# EAGLE design robot_main_board (EAGLE 9.0.0)
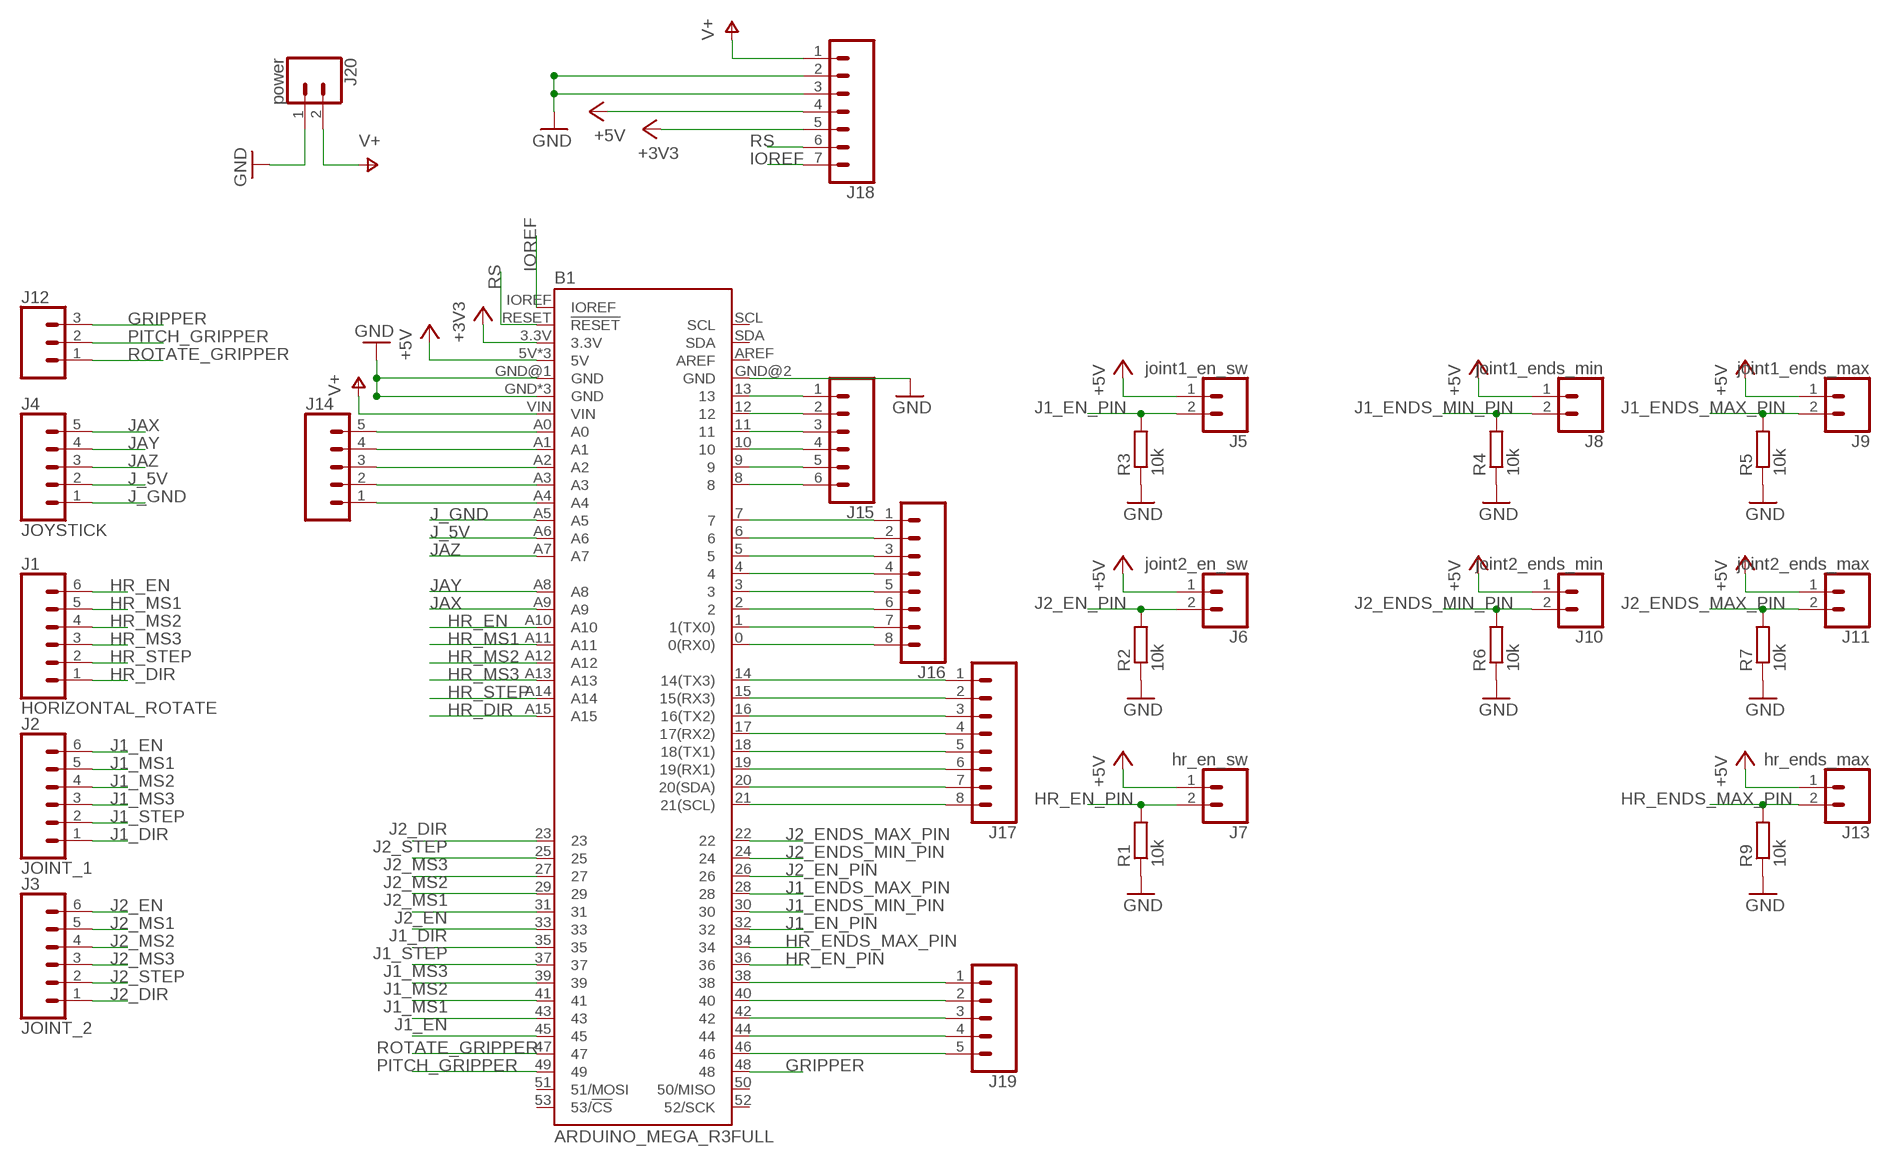
[diagram p0: schematic, sheet 1]

## Parts
B1  ARDUINO_MEGA_R3FULL  [ARDUINO_MEGA_NO_SILK]
J1  HORIZONTAL_ROTATE  CONN_06POLAR  [MOLEX-1X6]
J2  JOINT_1  CONN_06POLAR  [MOLEX-1X6]
J3  JOINT_2  CONN_06POLAR  [MOLEX-1X6]
J4  JOYSTICK  CONN_05  [1X05]
J5  joint1_en_sw  CONN_02POLAR  [MOLEX-1X2]
J6  joint2_en_sw  CONN_02POLAR  [MOLEX-1X2]
J7  hr_en_sw  CONN_02POLAR  [MOLEX-1X2]
J8  joint1_ends_min  CONN_02POLAR  [MOLEX-1X2]
J9  joint1_ends_max  CONN_02POLAR  [MOLEX-1X2]
J10  joint2_ends_min  CONN_02POLAR  [MOLEX-1X2]
J11  joint2_ends_max  CONN_02POLAR  [MOLEX-1X2]
J12  CONN_03POLAR  [MOLEX-1X3]
J13  hr_ends_max  CONN_02POLAR  [MOLEX-1X2]
J14  CONN_05  [1X05]
J15  CONN_06SILK_FEMALE_PTH  [1X06]
J16  CONN_08"  [1X08]
J17  CONN_08"  [1X08]
J18  CONN_07  [1X07]
J19  CONN_05  [1X05]
J20  power  CONN_02POLAR  [MOLEX-1X2]
R1  10k  R-EU_0204/7  [0204/7]
R2  10k  R-EU_0204/7  [0204/7]
R3  10k  R-EU_0204/7  [0204/7]
R4  10k  R-EU_0204/7  [0204/7]
R5  10k  R-EU_0204/7  [0204/7]
R6  10k  R-EU_0204/7  [0204/7]
R7  10k  R-EU_0204/7  [0204/7]
R9  10k  R-EU_0204/7  [0204/7]

## Nets
+3V3: B1.3.3V J18.5
+5V: B1.5V B1.5V@1(5V) B1.5V@2(5V) J5.1 J6.1 J7.1 J8.1 J9.1 J10.1 J11.1 J13.1 J18.4
GND: B1.GND B1.GND@1(GND) B1.GND@2(GND) B1.GND@3(GND) B1.GND@4(GND) J18.2 J18.3 J20.1 R1.1 R2.1 R3.1 R4.1 R5.1 R6.1 R7.1 R9.1
GRIPPER: B1.48 J12.3
HR_DIR: B1.A15 J1.1
HR_EN: B1.A10 J1.6
HR_EN_PIN: B1.36 J7.2 R1.2
HR_ENDS_MAX_PIN: B1.34 J13.2 R9.2
HR_MS1: B1.A11 J1.5
HR_MS2: B1.A12 J1.4
HR_MS3: B1.A13 J1.3
HR_STEP: B1.A14 J1.2
IOREF: B1.IOREF J18.7
J1_DIR: B1.35 J2.1
J1_EN: B1.45 J2.6
J1_EN_PIN: B1.32 J5.2 R3.2
J1_ENDS_MAX_PIN: B1.28 J9.2 R5.2
J1_ENDS_MIN_PIN: B1.30 J8.2 R4.2
J1_MS1: B1.43 J2.5
J1_MS2: B1.41 J2.4
J1_MS3: B1.39 J2.3
J1_STEP: B1.37 J2.2
J2_DIR: B1.23 J3.1
J2_EN: B1.33 J3.6
J2_EN_PIN: B1.26 J6.2 R2.2
J2_ENDS_MAX_PIN: B1.22 J11.2 R7.2
J2_ENDS_MIN_PIN: B1.24 J10.2 R6.2
J2_MS1: B1.31 J3.5
J2_MS2: B1.29 J3.4
J2_MS3: B1.27 J3.3
J2_STEP: B1.25 J3.2
J_5V: B1.A6 J4.2
J_GND: B1.A5 J4.1
JAX: B1.A9 J4.5
JAY: B1.A8 J4.4
JAZ: B1.A7 J4.3
N$1: B1.A4 J14.1
N$2: B1.A3 J14.2
N$3: B1.A2 J14.3
N$4: B1.A1 J14.4
N$5: B1.A0 J14.5
N$6: B1.13 J15.1
N$7: B1.12 J15.2
N$8: B1.11 J15.3
N$9: B1.10 J15.4
N$10: B1.9 J15.5
N$11: B1.8 J15.6
N$12: B1.7 J16.1
N$13: B1.6 J16.2
N$14: B1.5 J16.3
N$15: B1.4 J16.4
N$16: B1.3 J16.5
N$17: B1.2 J16.6
N$18: B1.1(1(TX0)) J16.7
N$19: B1.0(0(RX0)) J16.8
N$20: B1.14(14(TX3)) J17.1
N$21: B1.15(15(RX3)) J17.2
N$22: B1.16(16(TX2)) J17.3
N$23: B1.17(17(RX2)) J17.4
N$24: B1.18(18(TX1)) J17.5
N$25: B1.19(19(RX1)) J17.6
N$26: B1.20(20(SDA)) J17.7
N$27: B1.21(21(SCL)) J17.8
N$28: B1.38 J19.1
N$29: B1.40 J19.2
N$30: B1.42 J19.3
N$31: B1.44 J19.4
N$32: B1.46 J19.5
PITCH_GRIPPER: B1.49 J12.2
ROTATE_GRIPPER: B1.47 J12.1
RS: B1.RESET(!RESET) J18.6
V+: B1.VIN J18.1 J20.2
Unconnected: B1.50(50/MISO) B1.51(51/MOSI) B1.52(52/SCK) B1.53(53/!CS) B1.AREF B1.SCL B1.SDA

## Library data of the parts
B1 = SparkFun-Boards:ARDUINO_MEGA_R3: Arduino Mega R3 ATmega2560 R3 compatible footprint. SparkFun Products: Arduino Mega 2560 R3 <https://www.sparkfun.com/products/11061>
J1-J3 = SparkFun-Connectors:CONN_06: Multi connection point. Often used as Generic Header-pin footprint for 0.1 inch spaced/style header connections On any of the 0.1 inch spaced packages, you can populate with these: Break Away Headers - Straight <https://www.sparkfun.com/products/116> (PRT-00116) Break Away Male Headers - Right Angle <https://www.sparkfun.com/products/553> (PRT-00553) Female Headers <https://www.sparkfun.com/products/115> (PRT-00115) Break Away Headers - Machine Pin <https://www.sparkfun.com/products/117> (PRT-00117) Break Away Female Headers - Swiss Machine Pin <https://www.sparkfun.com/products/743> (PRT-00743) Arduino Stackable Header - 6 Pin <https://www.sparkfun.com/products/9280> (PRT-09280) For SCREWTERMINALS and SPRING TERMINALS visit here: Screw Terimnals on SparkFun.com <https://www.sparkfun.com/search/results?term=Screw+Terminals> (5mm/3.5mm/2.54mm spacing) This device is also useful as a general connection point to wire up your design to another part of your project. Our various solder wires solder well into these plated through hole pads. Hook-Up Wire - Assortment (Stranded, 22 AWG) <https://www.sparkfun.com/products/11375> (PRT-11375) Hook-Up Wire - Assortment (Solid Core, 22 AWG) <https://www.sparkfun.com/products/11367> (PRT-11367) View the entire wire category on our website here <https://www.sparkfun.com/categories/141>
J4 J14 J19 = SparkFun-Connectors:CONN_05: Multi connection point. Often used as Generic Header-pin footprint for 0.1 inch spaced/style header connections On any of the 0.1 inch spaced packages, you can populate with these: Break Away Headers - Straight <https://www.sparkfun.com/products/116> (PRT-00116) Break Away Male Headers - Right Angle <https://www.sparkfun.com/products/553> (PRT-00553) Female Headers <https://www.sparkfun.com/products/115> (PRT-00115) Break Away Headers - Machine Pin <https://www.sparkfun.com/products/117> (PRT-00117) Break Away Female Headers - Swiss Machine Pin <https://www.sparkfun.com/products/743> (PRT-00743) For SCREWTERMINALS and SPRING TERMINALS visit here: Screw Terimnals on SparkFun.com <https://www.sparkfun.com/search/results?term=Screw+Terminals> (5mm/3.5mm/2.54mm spacing) This device is also useful as a general connection point to wire up your design to another part of your project. Our various solder wires solder well into these plated through hole pads. Hook-Up Wire - Assortment (Stranded, 22 AWG) <https://www.sparkfun.com/products/11375> (PRT-11375) Hook-Up Wire - Assortment (Solid Core, 22 AWG) <https://www.sparkfun.com/products/11367> (PRT-11367) View the entire wire category on our website here <https://www.sparkfun.com/categories/141> Special notes: Molex polarized connector foot print use with SKU : PRT-08231 with associated crimp pins and housings. 1MM SMD Version SKU: PRT-10208
J5-J11 J13 J20 = SparkFun-Connectors:CONN_02: Multi connection point. Often used as Generic Header-pin footprint for 0.1 inch spaced/style header connections On any of the 0.1 inch spaced packages, you can populate with these: Break Away Headers - Straight <https://www.sparkfun.com/products/116> (PRT-00116) Break Away Male Headers - Right Angle <https://www.sparkfun.com/products/553> (PRT-00553) Female Headers <https://www.sparkfun.com/products/115> (PRT-00115) Break Away Headers - Machine Pin <https://www.sparkfun.com/products/117> (PRT-00117) Break Away Female Headers - Swiss Machine Pin <https://www.sparkfun.com/products/743> (PRT-00743) For SCREWTERMINALS and SPRING TERMINALS visit here: Screw Terimnals on SparkFun.com <https://www.sparkfun.com/search/results?term=Screw+Terminals> (5mm/3.5mm/2.54mm spacing) This device is also useful as a general connection point to wire up your design to another part of your project. Our various solder wires solder well into these plated through hole pads. Hook-Up Wire - Assortment (Stranded, 22 AWG) <https://www.sparkfun.com/products/11375> (PRT-11375) Hook-Up Wire - Assortment (Solid Core, 22 AWG) <https://www.sparkfun.com/products/11367> (PRT-11367) View the entire wire category on our website here <https://www.sparkfun.com/categories/141> Special notes: Molex polarized connector foot print use with: PRT-08233 with associated crimp pins and housings. 2.54_SCREWTERM for use with PRT-10571. 3.5mm Screw Terminal footprints for PRT-08084 5mm Screw Terminal footprints for use with PRT-08432; SF_ID: PRT-09918
J12 = SparkFun-Connectors:CONN_03: Multi connection point. Often used as Generic Header-pin footprint for 0.1 inch spaced/style header connections On any of the 0.1 inch spaced packages, you can populate with these: Break Away Headers - Straight <https://www.sparkfun.com/products/116> (PRT-00116) Break Away Male Headers - Right Angle <https://www.sparkfun.com/products/553> (PRT-00553) Female Headers <https://www.sparkfun.com/products/115> (PRT-00115) Break Away Headers - Machine Pin <https://www.sparkfun.com/products/117> (PRT-00117) Break Away Female Headers - Swiss Machine Pin <https://www.sparkfun.com/products/743> (PRT-00743) Stackable Header - 3 Pin (Female, 0.1") <https://www.sparkfun.com/products/13875> (PRT-13875) For SCREWTERMINALS and SPRING TERMINALS visit here: Screw Terimnals on SparkFun.com <https://www.sparkfun.com/search/results?term=Screw+Terminals> (5mm/3.5mm/2.54mm spacing) This device is also useful as a general connection point to wire up your design to another part of your project. Our various solder wires solder well into these plated through hole pads. Hook-Up Wire - Assortment (Stranded, 22 AWG) <https://www.sparkfun.com/products/11375> (PRT-11375) Hook-Up Wire - Assortment (Solid Core, 22 AWG) <https://www.sparkfun.com/products/11367> (PRT-11367) View the entire wire category on our website here <https://www.sparkfun.com/categories/141> Special notes: Molex polarized connector foot print use with SKU : PRT-08232 with associated crimp pins and housings.; PROD_ID: CONN-08625; SF_ID: PRT-08096
J15 = SparkFun-Connectors:CONN_06: Multi connection point. Often used as Generic Header-pin footprint for 0.1 inch spaced/style header connections On any of the 0.1 inch spaced packages, you can populate with these: Break Away Headers - Straight <https://www.sparkfun.com/products/116> (PRT-00116) Break Away Male Headers - Right Angle <https://www.sparkfun.com/products/553> (PRT-00553) Female Headers <https://www.sparkfun.com/products/115> (PRT-00115) Break Away Headers - Machine Pin <https://www.sparkfun.com/products/117> (PRT-00117) Break Away Female Headers - Swiss Machine Pin <https://www.sparkfun.com/products/743> (PRT-00743) Arduino Stackable Header - 6 Pin <https://www.sparkfun.com/products/9280> (PRT-09280) For SCREWTERMINALS and SPRING TERMINALS visit here: Screw Terimnals on SparkFun.com <https://www.sparkfun.com/search/results?term=Screw+Terminals> (5mm/3.5mm/2.54mm spacing) This device is also useful as a general connection point to wire up your design to another part of your project. Our various solder wires solder well into these plated through hole pads. Hook-Up Wire - Assortment (Stranded, 22 AWG) <https://www.sparkfun.com/products/11375> (PRT-11375) Hook-Up Wire - Assortment (Solid Core, 22 AWG) <https://www.sparkfun.com/products/11367> (PRT-11367) View the entire wire category on our website here <https://www.sparkfun.com/categories/141>; PROD_ID: CONN-08437
J16 J17 = SparkFun-Connectors:CONN_08: Multi connection point. Often used as Generic Header-pin footprint for 0.1 inch spaced/style header connections On any of the 0.1 inch spaced packages, you can populate with these: Break Away Headers - Straight <https://www.sparkfun.com/products/116> (PRT-00116) Break Away Male Headers - Right Angle <https://www.sparkfun.com/products/553> (PRT-00553) Female Headers <https://www.sparkfun.com/products/115> (PRT-00115) Break Away Headers - Machine Pin <https://www.sparkfun.com/products/117> (PRT-00117) Break Away Female Headers - Swiss Machine Pin <https://www.sparkfun.com/products/743> (PRT-00743) Arduino Stackable Header - 8 Pin <https://www.sparkfun.com/products/9279> (PRT-09279) For SCREWTERMINALS and SPRING TERMINALS visit here: Screw Terimnals on SparkFun.com <https://www.sparkfun.com/search/results?term=Screw+Terminals> (5mm/3.5mm/2.54mm spacing) This device is also useful as a general connection point to wire up your design to another part of your project. Our various solder wires solder well into these plated through hole pads. Hook-Up Wire - Assortment (Stranded, 22 AWG) <https://www.sparkfun.com/products/11375> (PRT-11375) Hook-Up Wire - Assortment (Solid Core, 22 AWG) <https://www.sparkfun.com/products/11367> (PRT-11367) View the entire wire category on our website here <https://www.sparkfun.com/categories/141> Special notes: Molex polarized connector foot print use with SKU : PRT-08231 with associated crimp pins and housings. 1MM SMD Version SKU: PRT-10208 NOTES ON THE VARIANTS LOCK and LOCK_LONGPADS... This footprint was designed to help hold the alignment of a through-hole component (i.e. 6-pin header) while soldering it into place. You may notice that each hole has been shifted either up or down by 0.005 of an inch from it's more standard position (which is a perfectly straight line). This slight alteration caused the pins (the squares in the middle) to touch the edges of the holes. Because they are alternating, it causes a "brace" to hold the component in place. 0.005 has proven to be the perfect amount of "off-center" position when using our standard breakaway headers. Although looks a little odd when you look at the bare footprint, once you have a header in there, the alteration is very hard to notice. Also,if you push a header all the way into place, it is covered up entirely on the bottom side.; PROD_ID: CONN-08438
J18 = SparkFun-Connectors:CONN_07: Multi connection point. Often used as Generic Header-pin footprint for 0.1 inch spaced/style header connections On any of the 0.1 inch spaced packages, you can populate with these: Break Away Headers - Straight <https://www.sparkfun.com/products/116> (PRT-00116) Break Away Male Headers - Right Angle <https://www.sparkfun.com/products/553> (PRT-00553) Female Headers <https://www.sparkfun.com/products/115> (PRT-00115) Break Away Headers - Machine Pin <https://www.sparkfun.com/products/117> (PRT-00117) Break Away Female Headers - Swiss Machine Pin <https://www.sparkfun.com/products/743> (PRT-00743) For SCREWTERMINALS and SPRING TERMINALS visit here: Screw Terimnals on SparkFun.com <https://www.sparkfun.com/search/results?term=Screw+Terminals> (5mm/3.5mm/2.54mm spacing) This device is also useful as a general connection point to wire up your design to another part of your project. Our various solder wires solder well into these plated through hole pads. Hook-Up Wire - Assortment (Stranded, 22 AWG) <https://www.sparkfun.com/products/11375> (PRT-11375) Hook-Up Wire - Assortment (Solid Core, 22 AWG) <https://www.sparkfun.com/products/11367> (PRT-11367) View the entire wire category on our website here <https://www.sparkfun.com/categories/141> Special notes: Molex polarized connector foot print use with SKU : PRT-08231 with associated crimp pins and housings. 1MM SMD Version SKU: PRT-10208 NOTES ON THE VARIANTS LOCK and LOCK_LONGPADS... This footprint was designed to help hold the alignment of a through-hole component (i.e. 6-pin header) while soldering it into place. You may notice that each hole has been shifted either up or down by 0.005 of an inch from it's more standard position (which is a perfectly straight line). This slight alteration caused the pins (the squares in the middle) to touch the edges of the holes. Because they are alternating, it causes a "brace" to hold the component in place. 0.005 has proven to be the perfect amount of "off-center" position when using our standard breakaway headers. Although looks a little odd when you look at the bare footprint, once you have a header in there, the alteration is very hard to notice. Also,if you push a header all the way into place, it is covered up entirely on the bottom side.
R1-R7 R9 = resistor:R-EU_: RESISTOR, European symbol

## Board
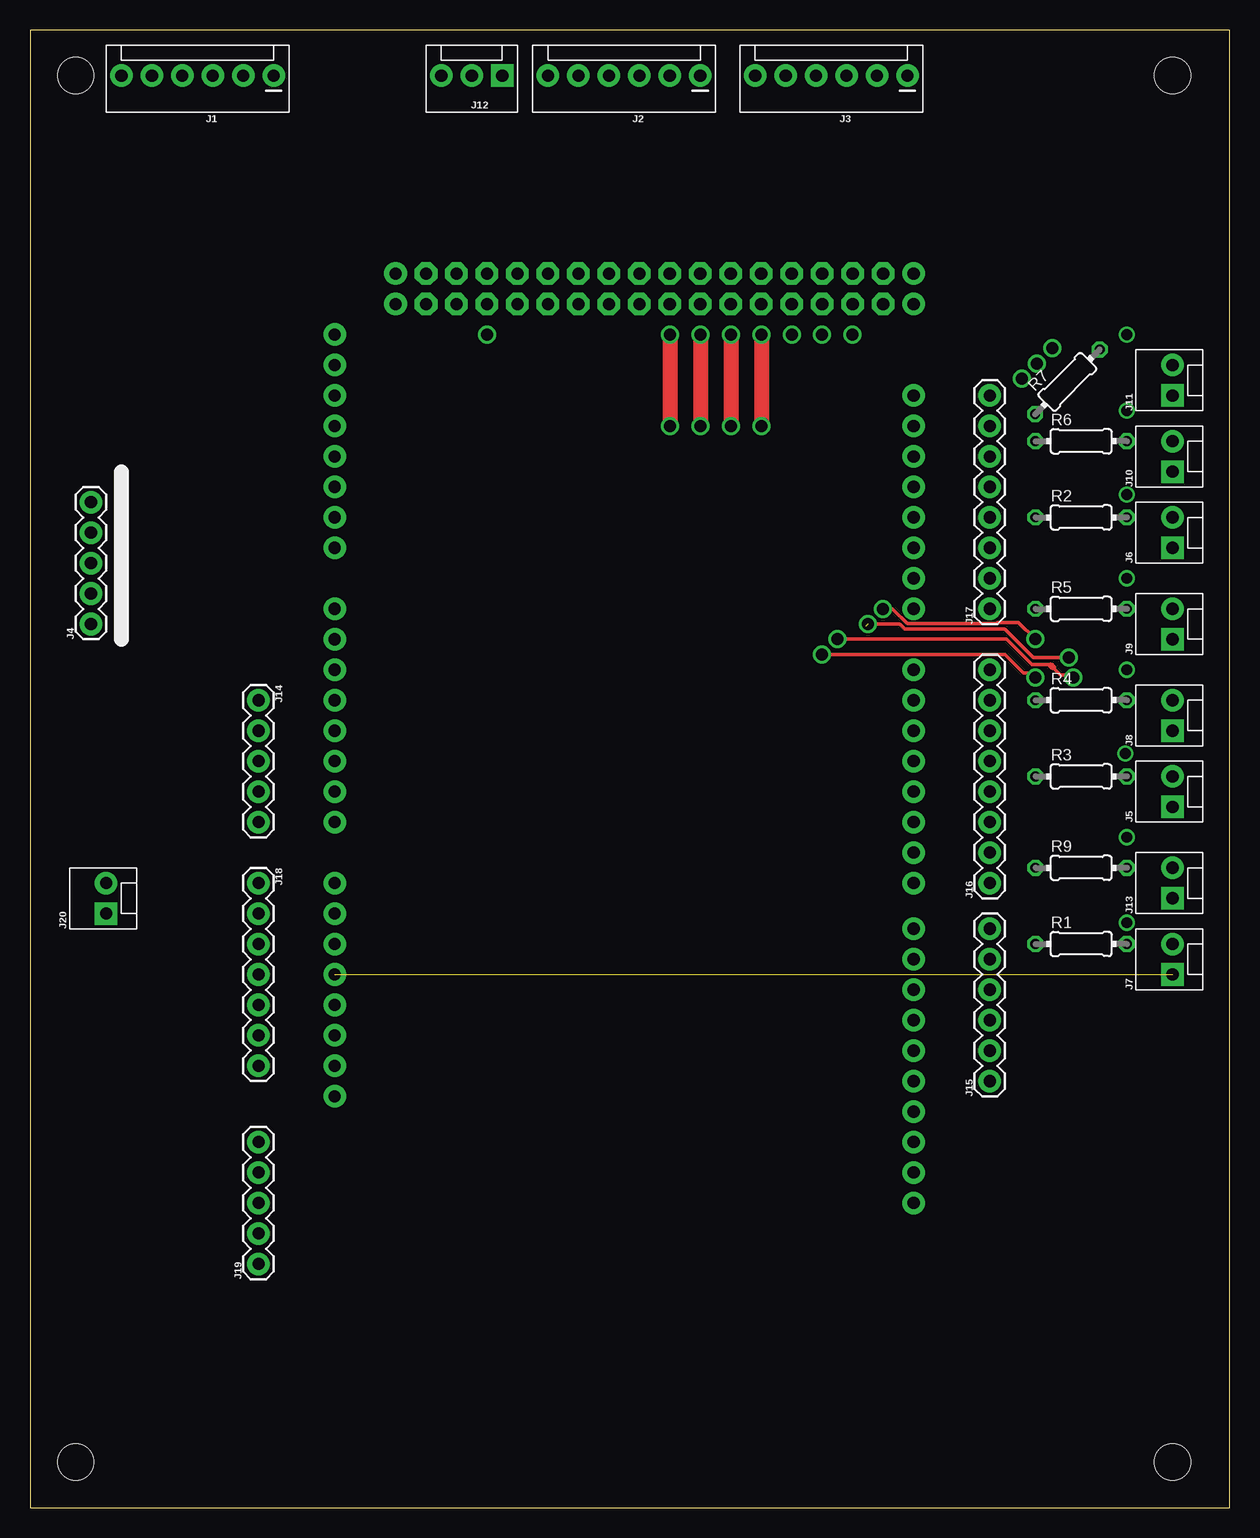
[diagram p1: board, top side]
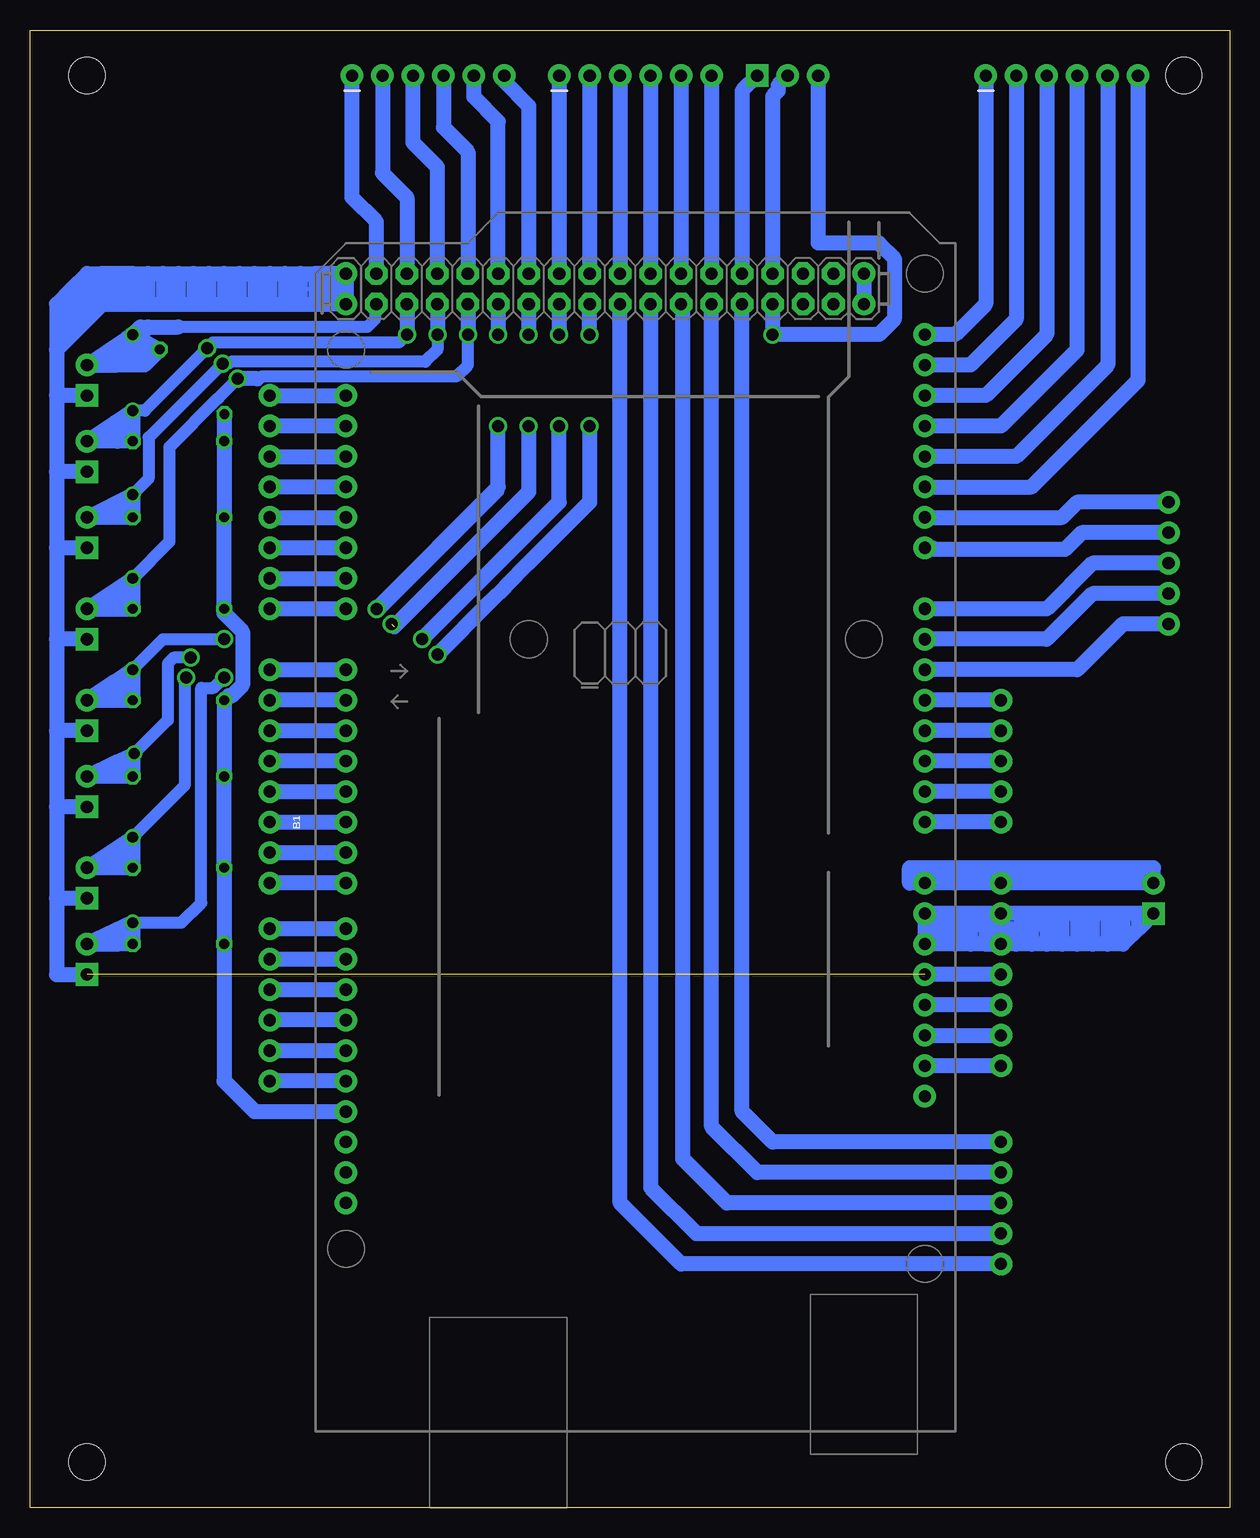
[diagram p2: board, bottom side, seen from below]

Size 100 x 123.18 mm. Coordinates in mm from the lower left corner, seen from the top.
Outline: 0,0 100,0 100,123.18 0,123.18 0,0
Copper layers (1*16): Top 0.035mm / dielectric 1.5mm / Bottom 0.035mm
Design rules "default": minimum track width 6mil, minimum drill 0.35mm, track to track 6mil, track to pad 6mil, pad to pad 6mil, via to via 6mil, smd to smd 6mil, copper to edge 40mil, drill to drill 6mil, minimum pad ring 10mil, minimum via ring 8mil, stop-mask expansion 4mil, vias tented up to drill 0mil, thermal gap 10mil
Holes 3 mm at 95.25,119.38 3.81,119.38 3.81,3.81 95.25,3.81

### Footprints (pad centres in the part's own frame; a part is rotated, then mirrored left to right if it is on the bottom)
ARDUINO_MEGA_NO_SILK = drill 1.016 pad 1.88: 0 13.97,24.13; 1 11.43,24.13; 2 8.89,24.13; 3 6.35,24.13; 3.3V -13.97,-24.13; 4 3.81,24.13; 5 1.27,24.13; 5V -11.43,-24.13; 5V@1 44.45,24.13; 5V@2 46.99,24.13; 6 -1.27,24.13; 7 -3.81,24.13; 8 -7.62,24.13; 9 -10.16,24.13; 10 -12.7,24.13; 11 -15.24,24.13; 12 -17.78,24.13; 13 -20.32,24.13; 14 19.05,24.13; 15 21.59,24.13; 16 24.13,24.13; 17 26.67,24.13; 18 29.21,24.13; 19 31.75,24.13; 20 34.29,24.13; 21 36.83,24.13; A0 1.27,-24.13; A1 3.81,-24.13; A2 6.35,-24.13; A3 8.89,-24.13; A4 11.43,-24.13; A5 13.97,-24.13; A6 16.51,-24.13; A7 19.05,-24.13; A8 24.13,-24.13; A9 26.67,-24.13; A10 29.21,-24.13; A11 31.75,-24.13; A12 34.29,-24.13; A13 36.83,-24.13; A14 39.37,-24.13; A15 41.91,-24.13; AREF -25.4,24.13; GND -8.89,-24.13; GND@1 -6.35,-24.13; GND@2 44.45,-19.05; GND@3 46.99,-19.05; GND@4 -22.86,24.13; IOREF -19.05,-24.13; NC -21.59,-24.13; RESET -16.51,-24.13; SCL -30.48,24.13; SDA -27.94,24.13; VIN -3.81,-24.13 | drill 1.016 pad 1.88 octagon: 22 44.45,21.59; 23 46.99,21.59; 24 44.45,19.05; 25 46.99,19.05; 26 44.45,16.51; 27 46.99,16.51; 28 44.45,13.97; 29 46.99,13.97; 30 44.45,11.43; 31 46.99,11.43; 32 44.45,8.89; 33 46.99,8.89; 34 44.45,6.35; 35 46.99,6.35; 36 44.45,3.81; 37 46.99,3.81; 38 44.45,1.27; 39 46.99,1.27; 40 44.45,-1.27; 41 46.99,-1.27; 42 44.45,-3.81; 43 46.99,-3.81; 44 44.45,-6.35; 45 46.99,-6.35; 46 44.45,-8.89; 47 46.99,-8.89; 48 44.45,-11.43; 49 46.99,-11.43; 50 44.45,-13.97; 51 46.99,-13.97; 52 44.45,-16.51; 53 46.99,-16.51
MOLEX-1X6 = drill 1.016 pad 1.88: 1 0,0; 2 2.54,0; 3 5.08,0; 4 7.62,0; 5 10.16,0; 6 12.7,0
1X05 = drill 1.016 pad 1.88: 1 0,0; 2 2.54,0; 3 5.08,0; 4 7.62,0; 5 10.16,0
MOLEX-1X2 = drill 1.016 pad 1.88 square: 1 0,0 | drill 1.016 pad 1.88: 2 2.54,0
MOLEX-1X3 = drill 1.016 pad 1.88 square: 1 0,0 | drill 1.016 pad 1.88: 2 2.54,0; 3 5.08,0
1X06 = drill 1.016 pad 1.88: 1 0,0; 2 2.54,0; 3 5.08,0; 4 7.62,0; 5 10.16,0; 6 12.7,0
1X08 = drill 1.016 pad 1.88: 1 0,0; 2 2.54,0; 3 5.08,0; 4 7.62,0; 5 10.16,0; 6 12.7,0; 7 15.24,0; 8 17.78,0
1X07 = drill 1.016 pad 1.88: 1 0,0; 2 2.54,0; 3 5.08,0; 4 7.62,0; 5 10.16,0; 6 12.7,0; 7 15.24,0
0204/7 = drill 0.813 octagon: 1 -3.81,0; 2 3.81,0

### Placement (x,y rotation side)
B1  49.53,55.88 90 bottom
J1  20.32,119.38 180 top
J2  55.88,119.38 180 top
J3  73.15,119.38 180 top
J4  5.08,73.66 90 top
J5  95.25,58.42 90 top
J6  95.25,80.01 90 top
J7  95.25,44.45 90 top
J8  95.25,64.77 90 top
J9  95.25,72.39 90 top
J10  95.25,86.36 90 top
J11  95.25,92.71 90 top
J12  39.37,119.38 180 top
J13  95.25,50.8 90 top
J14  19.05,67.31 270 top
J15  80.01,35.56 90 top
J16  80.01,52.07 90 top
J17  80.01,74.93 90 top
J18  19.05,52.07 270 top
J19  19.05,20.32 90 top
J20  6.35,49.53 90 top
R1  87.63,46.99 0 top
R2  87.63,82.55 0 top
R3  87.63,60.96 0 top
R4  87.63,67.31 0 top
R5  87.63,74.93 0 top
R6  87.63,88.9 0 top
R7  86.49,93.85 45 top
R9  87.63,53.34 0 top

### Tracks (layer width: path | path; a pad name or v marks a point on that pad's centre or on a via)
+3V3
  Bottom 1.27: J18.5 B1.3.3V
+5V  (1 unrouted)
  Bottom 1.27: B1.5V@2 73.66,101.6 | 73.66,101.6 B1.5V@1 74.93,100.33 | 97.79,96.52 97.79,92.71 | 97.79,92.71 97.79,86.36 | 97.79,58.42 97.79,50.8 | 97.79,50.8 97.79,44.45 J7.1 | J13.1 97.79,50.8 | J5.1 97.79,58.42 | J10.1 97.79,86.36 | J11.1 97.79,92.71 | 97.79,86.36 97.79,80.01 | 97.79,80.01 97.79,72.39 | 97.79,72.39 97.79,64.77 | 97.79,64.77 97.79,58.42 | J8.1 97.79,64.77 | J9.1 97.79,72.39 | J6.1 97.79,80.01 | 93.98,100.33 95.25,99.06 | 95.25,99.06 96.52,97.79 | 96.52,97.79 97.79,96.52 | J18.4 B1.5V | 93.98,100.33 92.71,100.33 | 92.71,100.33 91.44,100.33 | 91.44,100.33 90.17,100.33 | 90.17,100.33 88.9,100.33 | 88.9,100.33 87.63,100.33 | 87.63,100.33 86.36,100.33 | 86.36,100.33 85.09,100.33 | 85.09,100.33 83.82,100.33 | 83.82,100.33 82.55,100.33 | 82.55,100.33 81.28,100.33 | 81.28,100.33 80.01,100.33 | 80.01,100.33 78.74,100.33 | 78.74,100.33 77.47,100.33 | 77.47,100.33 76.2,100.33 | 76.2,100.33 74.93,100.33 | 74.93,100.33 74.3,100.97 | 74.3,100.97 73.66,101.6 | B1.5V@2 76.2,102.87 | 93.98,100.33 92.71,101.6 | 92.71,101.6 92.08,102.23 | 92.08,102.23 91.44,102.87 | 91.44,102.87 90.17,102.87 | 90.17,102.87 88.9,102.87 | 88.9,102.87 87.63,102.87 | 87.63,102.87 86.36,102.87 | 86.36,102.87 85.09,102.87 | 85.09,102.87 83.82,102.87 | 83.82,102.87 82.55,102.87 | 82.55,102.87 81.28,102.87 | 81.28,102.87 80.01,102.87 | 80.01,102.87 78.74,102.87 | 78.74,102.87 77.47,102.87 | 77.47,102.87 76.2,102.87 | 76.2,102.87 74.93,101.6 | B1.5V@2 74.3,102.23 74.3,100.97 | 76.2,102.87 76.2,101.6 | 76.2,101.6 74.93,100.33 | 76.2,101.6 76.2,100.33 | 77.47,102.87 77.47,100.33 | 78.74,102.87 78.74,100.33 | 80.01,102.87 80.01,100.33 | 81.28,102.87 81.28,100.33 | 82.55,102.87 82.55,100.33 | 83.82,102.87 83.82,100.33
  Bottom 1.27: 85.09,102.87 85.09,100.33 | 86.36,102.87 86.36,100.33 | 87.63,102.87 87.63,100.33 | 88.9,102.87 88.9,100.33 | 90.17,102.87 90.17,100.33 | 91.44,102.87 91.44,100.33 | 92.08,102.23 92.08,100.97 92.71,100.33 | 91.44,102.87 93.98,102.87 | 97.79,100.33 97.79,96.52 | 96.52,100.33 96.52,97.79 | 96.52,101.6 96.52,100.33 | 96.52,100.33 95.89,99.69 | 95.89,99.69 95.25,99.06 | 95.25,102.87 95.25,100.33 95.89,99.69 | 93.98,102.87 93.98,100.33 | 93.98,102.87 92.71,101.6 | 96.52,101.6 97.79,100.33 | 96.52,101.6 95.25,102.87 | 95.25,102.87 93.98,102.87 | 93.98,102.87 96.52,100.33 | 96.52,100.33 97.79,100.33
GND
  Bottom 1.27: B1.GND@3 B1.GND@2 | B1.GND@1 B1.GND | R7.1 R6.1 R2.1 R5.1 83.82,74.56 82.28,73.03 82.28,68.58 83.18,67.68 83.45,67.68 R4.1 R3.1 R9.1 R1.1 83.82,35.56 81.28,33.02 B1.GND@4 | 20.32,46.99 21.59,46.99 | 21.59,46.99 22.86,46.99 | 22.86,46.99 B1.GND | 21.59,49.53 20.32,49.53 20.32,46.99 | 21.59,49.53 22.86,49.53 | 22.86,49.53 B1.GND | B1.GND@1 24.13,49.53 | 24.13,49.53 22.86,49.53 | 21.59,49.53 20.32,48.26 | 21.59,48.26 21.59,46.99 | 21.59,49.53 21.59,48.26 | 21.59,48.26 22.86,46.99 | 22.86,49.53 22.86,48.26 | 24.13,49.53 24.13,48.26 22.86,46.99 | 20.32,46.99 J18.3 | J18.3 19.05,48.26 | 19.05,48.26 J18.2 | J18.2 B1.GND@1 | 7.62,49.53 J20.1 7.62,48.26 | 7.62,49.53 8.89,49.53 | 8.89,49.53 10.16,49.53 | 10.16,49.53 11.43,49.53 | 11.43,49.53 12.7,49.53 | 12.7,49.53 13.97,49.53 | 13.97,49.53 15.24,49.53 | 15.24,49.53 16.51,49.53 | 16.51,49.53 J18.2 | 8.89,46.99 10.16,46.99 | 10.16,46.99 11.43,46.99 | 11.43,46.99 12.7,46.99 | 12.7,46.99 13.97,46.99 | 13.97,46.99 15.24,46.99 | 15.24,46.99 16.51,46.99 | 16.51,46.99 17.78,46.99 | 17.78,46.99 J18.3 | 7.62,48.26 8.89,46.99 | 7.62,49.53 7.62,48.26 | 8.89,49.53 8.89,46.99 | 10.16,49.53 10.16,46.99 | 11.43,49.53 11.43,46.99 | 12.7,49.53 12.7,46.99 | 13.97,49.53 13.97,46.99 | 15.24,49.53 15.24,46.99 | 15.24,49.53 16.51,48.26 16.51,46.99 | 16.51,49.53 17.78,48.26 | 17.78,48.26 17.78,46.99 | 17.78,48.26 19.05,48.26
GRIPPER  (via drill 1)
  Bottom 1.27: B1.48 v38.1,97.79 29.21,97.79 27.94,99.06 27.94,104.14 29.21,105.41 34.29,105.41 J12.3
HR_DIR
  Bottom 1.27: J1.1 20.32,100.33 22.86,97.79 B1.A15
HR_EN
  Bottom 1.27: B1.A10 16.51,85.09 7.62,93.98 J1.6
HR_EN_PIN  (via drill 0.9, 1)
  Top 0.305: v66.04,71.12 81.27,71.12 82.81,69.58 83.45,69.58 v83.82,69.22
  Top 1.27: v53.34,97.79 v53.34,90.17
  Bottom 1.016: 53.34,83.82 53.98,83.19 | 61.59,75.56 65.91,71.25 | v91.44,48.77 87.38,48.77 85.72,50.42 85.72,68.33 84.71,68.33 v83.82,69.22
  Bottom 1.27: 92.71,46.99 R1.2 v91.44,48.77 | 92.71,46.99 J7.2 v91.44,48.77 | v91.44,48.77 92.71,46.99 | v53.34,97.79 B1.36 | v53.34,90.17 53.34,83.82 58.42,78.74 60.33,76.84 61.59,75.56 v66.04,71.12
HR_ENDS_MAX_PIN  (via drill 0.9, 1)
  Top 0.305: v67.31,72.39 81.41,72.39 83.53,70.27 85.05,70.27 85.28,70.04 85.92,69.41 86.81,69.41 v87,69.22
  Top 0.508: 85.28,70.04 85.09,70.23
  Top 1.27: v55.88,97.79 v55.88,90.17
  Bottom 1.016: v91.44,55.88 87.12,60.2 87.12,69.09 v87,69.22
  Bottom 1.27: 91.44,54.61 v91.44,55.88 J13.2 92.71,53.34 | 91.44,54.61 R9.2 92.71,53.34 | 91.44,54.61 92.71,54.61 92.71,53.34 | B1.34 v55.88,97.79 | v67.31,72.39 55.88,83.82 v55.88,90.17
HR_MS1
  Bottom 1.27: J1.5 10.16,95.25 17.78,87.63 B1.A11
HR_MS2
  Bottom 1.27: J1.4 12.7,96.52 19.05,90.17 B1.A12
HR_MS3
  Bottom 1.27: J1.3 15.24,97.79 20.32,92.71 B1.A13
HR_STEP
  Bottom 1.27: J1.2 17.78,99.06 21.59,95.25 B1.A14
IOREF
  Bottom 1.27: J18.7 B1.IOREF
J1_DIR
  Bottom 1.27: J2.1 B1.35
J1_EN
  Bottom 1.27: J2.6 B1.45
J1_EN_PIN  (via drill 0.9, 1)  (1 unrouted)
  Top 0.305: v69.85,73.66 72.52,73.66 72.95,73.23 81.28,73.23 83.65,70.85 86.6,70.85
  Top 0.508: 86.6,70.85 v86.61,70.85
  Top 1.27: v58.42,97.79 v58.42,90.17
  Bottom 1.016: v86.61,70.85 88.02,70.85 88.52,70.36 88.52,65.66 v91.31,62.86
  Bottom 1.27: 92.71,60.96 R3.2 91.44,62.74 92.69,62.2 J5.2 92.71,60.96 | v91.31,62.86 92.71,60.96 | B1.32 v58.42,97.79 | v58.42,90.17 58.42,84.66 69.64,73.45
J1_ENDS_MAX_PIN  (via drill 0.9, 1)
  Bottom 1.016: v63.5,97.79 63.5,95.25 64.44,94.31 80.67,94.31 81,93.98 82.42,93.98 82.55,94.11 | v82.68,94.11 84.3,92.48 84.34,92.48 88.39,88.43 88.39,80.52 v91.44,77.47
  Bottom 1.27: J9.2 R5.2 | v91.44,77.47 R5.2 | v91.44,77.47 J9.2 | 92.71,76.2 J9.2 | v91.44,77.47 92.71,76.2 | R5.2 92.71,76.2 | B1.28 v63.5,97.79 | 81.06,94.11 82.55,94.11 v82.68,94.11
J1_ENDS_MIN_PIN  (via drill 0.9, 1)
  Top 0.305: v83.82,72.39 82.41,73.8 80.64,73.8 80.53,73.69 73.14,73.69 71.9,74.93 v71.12,74.93
  Top 1.27: v60.96,97.79 v60.96,90.17
  Bottom 1.016: 70.93,74.74 60.96,84.71 v60.96,90.17 | v91.44,69.85 88.9,72.39 v83.82,72.39
  Bottom 1.27: 92.71,67.31 J8.2 92.91,68.87 | 92.71,67.31 R4.2 | R4.2 v91.44,69.85 92.91,68.87 | R4.2 92.71,68.58 | 92.91,68.87 92.71,67.31 | B1.30 v60.96,97.79 | v71.12,74.93 60.96,85.09 v60.96,90.17
J1_MS1
  Bottom 1.27: J2.5 B1.43
J1_MS2
  Bottom 1.27: J2.4 B1.41
J1_MS3
  Bottom 1.27: J2.3 B1.39
J1_STEP
  Bottom 1.27: J2.2 B1.37
J2_DIR
  Bottom 1.27: J3.1 73.15,109.22 71.12,107.19 B1.23
J2_EN
  Bottom 1.27: J3.6 60.45,118.87 58.42,116.84 B1.33
J2_EN_PIN  (via drill 0.9, 1)
  Bottom 1.016: v66.04,97.79 66.04,96.52 67.04,95.52 83.26,95.52 83.4,95.38 v83.95,95.38 90.12,89.2 90.12,85.78 v91.44,84.45
  Bottom 1.27: 92.71,82.55 R2.2 v91.44,84.45 | 92.71,82.55 J6.2 v91.44,84.45 | v91.44,84.45 92.71,82.55 | B1.26 v66.04,97.79
J2_ENDS_MAX_PIN  (via drill 0.9)
  Bottom 1.016: B1.22 71.25,100.2 71.25,99.06 71.88,98.42 87.63,98.42 90.17,98.42 | v91.44,97.79 91.44,96.52 90.17,96.52 | 90.17,98.42 91.2,97.4 92.03,97.4 | 90.81,98.42 90.17,98.42
  Bottom 1.27: J11.2 92.71,95.25 | 92.71,95.25 R7.2 | v91.44,97.79 92.03,97.4 | 92.03,97.4 J11.2 | v91.44,97.79 R7.2 | 92.03,97.4 92.71,95.25 | v91.44,97.79 90.81,98.42 87.63,98.42 | 90.17,98.42 93.34,95.25 J11.2 | R7.2 90.48,95.25 J11.2
J2_ENDS_MIN_PIN  (via drill 0.9, 1)
  Bottom 1.016: v68.58,97.79 69.24,97.13 84.73,97.13 v85.22,96.65 90.42,91.44 v91.44,91.44
  Bottom 1.27: 92.71,88.9 R6.2 91.44,90.17 | 92.71,88.9 J10.2 92.91,90.46 | 91.44,90.17 v91.44,91.44 92.91,90.46 | 91.44,90.17 92.71,88.9 | 92.91,90.46 92.71,88.9 | B1.24 v68.58,97.79
J2_MS1
  Bottom 1.27: B1.31 60.96,115.57 62.99,117.6 J3.5
J2_MS2
  Bottom 1.27: J3.4 65.53,115.06 63.5,113.03 B1.29
J2_MS3
  Bottom 1.27: B1.27 66.04,111.76 68.07,113.79 J3.3
J2_STEP
  Bottom 1.27: J3.2 70.61,111.25 68.58,109.22 B1.25
J_5V
  Bottom 1.27: J4.2 11.43,76.2 15.24,72.39 B1.A6
J_GND
  Bottom 1.27: J4.1 8.89,73.66 12.7,69.85 B1.A5
JAX
  Bottom 1.27: J4.5 12.7,83.82 13.97,82.55 B1.A9
JAY
  Bottom 1.27: B1.A8 24.77,80.01 24.64,79.88 13.72,79.88 12.32,81.28 J4.4
JAZ
  Bottom 1.27: J4.3 11.43,78.74 15.24,74.93 B1.A7
N$1
  Bottom 1.27: J14.1 B1.A4
N$2
  Bottom 1.27: J14.2 B1.A3
N$3
  Bottom 1.27: J14.3 B1.A2
N$4
  Bottom 1.27: J14.4 B1.A1
N$5
  Bottom 1.27: J14.5 B1.A0
N$6
  Bottom 1.27: B1.13 J15.1
N$7
  Bottom 1.27: J15.2 B1.12
N$8
  Bottom 1.27: B1.11 J15.3
N$9
  Bottom 1.27: B1.10 J15.4
N$10
  Bottom 1.27: B1.9 J15.5
N$11
  Bottom 1.27: B1.8 J15.6
N$12
  Bottom 1.27: B1.7 J16.1
N$13
  Bottom 1.27: J16.2 B1.6
N$14
  Bottom 1.27: J16.3 B1.5
N$15
  Bottom 1.27: J16.4 B1.4
N$16
  Bottom 1.27: B1.3 J16.5
N$17
  Bottom 1.27: J16.6 B1.2
N$18
  Bottom 1.27: B1.1 J16.7
N$19
  Bottom 1.27: J16.8 B1.0
N$20
  Bottom 1.27: B1.14 J17.1
N$21
  Bottom 1.27: J17.2 B1.15
N$22
  Bottom 1.27: B1.16 J17.3
N$23
  Bottom 1.27: J17.4 B1.17
N$24
  Bottom 1.27: B1.18 J17.5
N$25
  Bottom 1.27: J17.6 B1.19
N$26
  Bottom 1.27: B1.20 J17.7
N$27
  Bottom 1.27: J17.8 B1.21
N$28
  Bottom 1.27: J19.1 45.72,20.32 50.8,25.4 B1.38
N$29
  Bottom 1.27: B1.40 48.26,26.67 44.45,22.86 J19.2
N$30
  Bottom 1.27: J19.3 41.91,25.4 45.57,29.06 45.57,100.18 B1.42
N$31
  Bottom 1.27: J19.4 39.37,27.94 43.18,31.75 B1.44
N$32
  Bottom 1.27: J19.5 38.1,30.48 40.64,33.02 B1.46
PITCH_GRIPPER
  Bottom 1.27: J12.2 37.64,118.57 37.64,118.11 38.1,117.66 B1.49
ROTATE_GRIPPER
  Bottom 1.27: J12.1 40.64,118.11 B1.47
RS
  Bottom 1.27: B1.RESET J18.6
V+
  Bottom 1.27: B1.VIN 22.86,52.07 J18.1 J20.2 6.35,53.34 25.4,53.34 | 25.4,53.34 B1.VIN | 25.4,53.34 26.67,53.34 26.67,52.07 B1.VIN